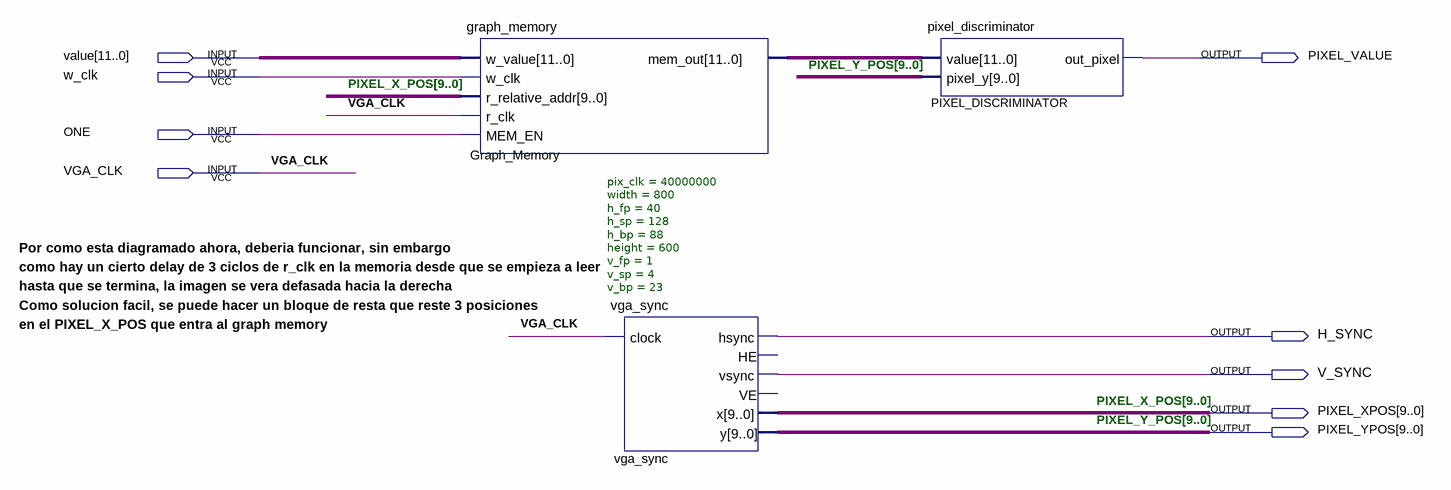
[diagram p0: schematic sheet]
// Quartus schematic Graphikher.bdf as structural Verilog: 3 symbols, 9 pins
module Graphikher (
  input  [11:0] value,
  input  w_clk,
  input  ONE,
  input  VGA_CLK,
  output PIXEL_VALUE,
  output H_SYNC,
  output V_SYNC,
  output [9:0] PIXEL_XPOS,
  output [9:0] PIXEL_YPOS
);

  wire [11:0] Graph_Memory_mem_out;

  graph_memory Graph_Memory (
    .w_value(value), .w_clk(w_clk), .r_relative_addr(PIXEL_XPOS), .r_clk(VGA_CLK), .MEM_EN(ONE),
    .mem_out(Graph_Memory_mem_out));
  vga_sync #(.pix_clk(40000000), .width(800), .h_fp(40), .h_sp(128), .h_bp(88), .height(600), .v_fp(1), .v_sp(4), .v_bp(23)) vga_sync (
    .clock(VGA_CLK), .hsync(H_SYNC), .vsync(V_SYNC), .x(PIXEL_XPOS), .y(PIXEL_YPOS));  // open: HE, VE
  pixel_discriminator PIXEL_DISCRIMINATOR (.value(Graph_Memory_mem_out), .pixel_y(PIXEL_YPOS), .out_pixel(PIXEL_VALUE));

  // Other names for the same wires on the sheet: PIXEL_X_POS[9:0] = PIXEL_XPOS; PIXEL_Y_POS[9:0] = PIXEL_YPOS

  // Notes on the sheet:
  //   Por como esta diagramado ahora, deberia funcionar, sin embargo
  //   como hay un cierto delay de 3 ciclos de r_clk en la memoria desde que se empieza a leer
  //   hasta que se termina, la imagen se vera defasada hacia la derecha
  //   Como solucion facil, se puede hacer un bloque de resta que reste 3 posiciones
  //   en el PIXEL_X_POS que entra al graph memory
endmodule
